# EAGLE design AirHarp Pico 1.001 (EAGLE 7.1.0)
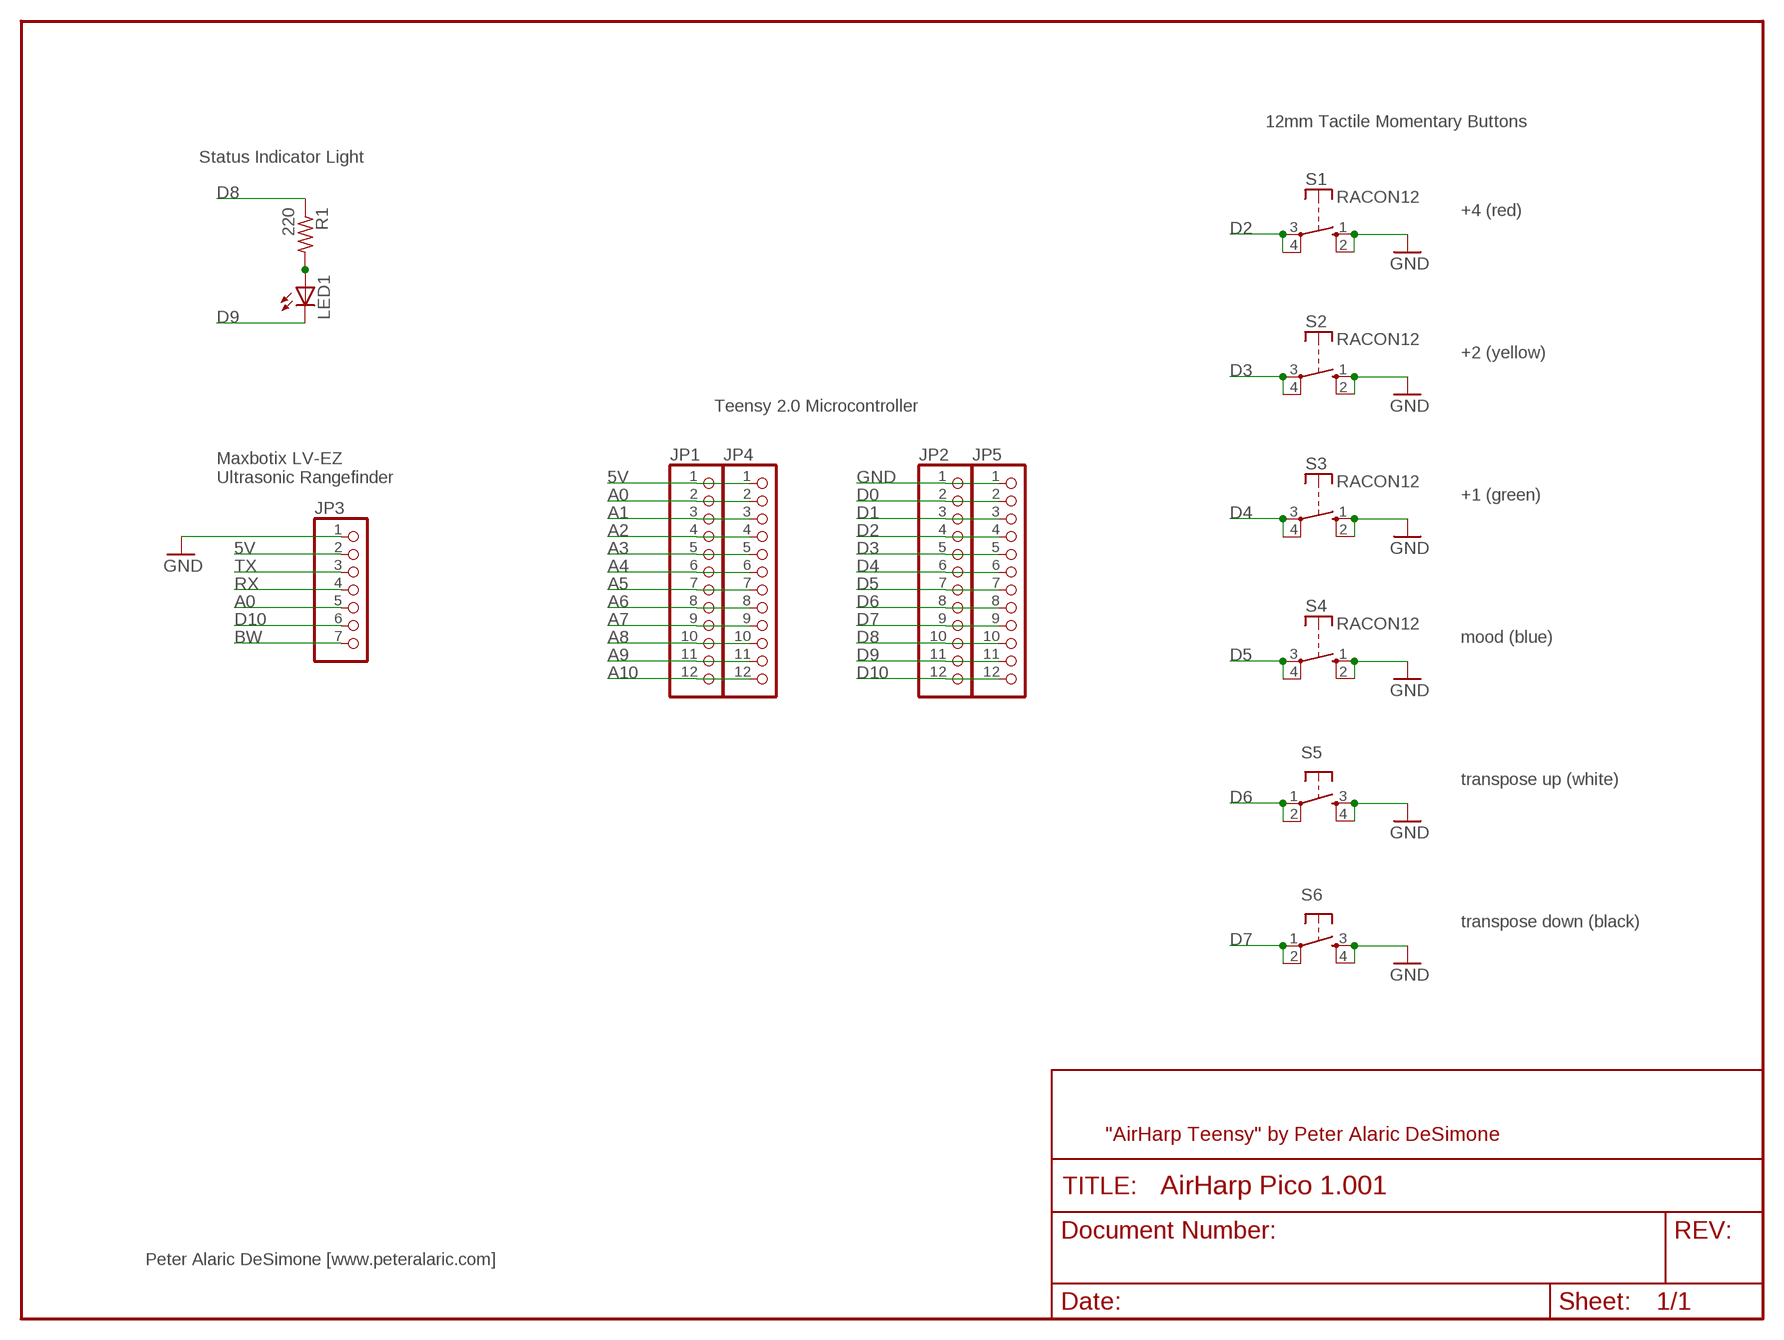
[diagram p0: schematic, sheet 1]

## Parts
JP1  PINHD-1X12  [1X12]
JP2  PINHD-1X12  [1X12]
JP3  PINHD-1X7  [1X07]
JP4  PINHD-1X12  [1X12]
JP5  PINHD-1X12  [1X12]
LED1  LED10MM  [LED10MM]
R1  220  R-US_0207/7  [0207/7]
S1  RACON12  [RACON12]
S2  RACON12  [RACON12]
S3  RACON12  [RACON12]
S4  RACON12  [RACON12]
S5  TAC_SWITCHPTH  [TACTILE-PTH]
S6  TAC_SWITCHPTH  [TACTILE-PTH]

## Nets
5V: JP1.1 JP3.2 JP4.1
A0: JP1.2 JP3.5 JP4.2
A1: JP1.3 JP4.3
A2: JP1.4 JP4.4
A3: JP1.5 JP4.5
A4: JP1.6 JP4.6
A5: JP1.7 JP4.7
A6: JP1.8 JP4.8
A7: JP1.9 JP4.9
A8: JP1.10 JP4.10
A9: JP1.11 JP4.11
A10: JP1.12 JP4.12
BW: JP3.7
D0: JP2.2 JP5.2
D1: JP2.3 JP5.3
D2: JP2.4 JP5.4 S1.3(P) S1.4(P)
D3: JP2.5 JP5.5 S2.3(P) S2.4(P)
D4: JP2.6 JP5.6 S3.3(P) S3.4(P)
D5: JP2.7 JP5.7 S4.3(P) S4.4(P)
D6: JP2.8 JP5.8 S5.1 S5.2
D7: JP2.9 JP5.9 S6.1 S6.2
D8: JP2.10 JP5.10 R1.1
D9: JP2.11 JP5.11 LED1.K(C)
D10: JP2.12 JP3.6 JP5.12
GND: JP2.1 JP3.1 JP5.1 S1.1(S) S1.2(S) S2.1(S) S2.2(S) S3.1(S) S3.2(S) S4.1(S) S4.2(S) S5.3 S5.4 S6.3 S6.4
N$1: LED1.A R1.2
RX: JP3.4
TX: JP3.3

## Notes on the sheet
- 12mm Tactile Momentary Buttons
- Status Indicator Light
- +4 (red)
- +2 (yellow)
- Teensy 2.0 Microcontroller
- Maxbotix LV-EZ
  Ultrasonic Rangefinder
- +1 (green)
- mood (blue)
- transpose up (white)
- transpose down (black)
- "AirHarp Teensy" by Peter Alaric DeSimone
- Peter Alaric DeSimone [www.peteralaric.com]

## Library data of the parts
JP1 JP2 JP4 JP5 = pinhead:PINHD-1X12: PIN HEADER
JP3 = pinhead:PINHD-1X7: PIN HEADER
LED1 = led:LED: LED OSRAM: - CHIPLED LG R971, LG N971, LY N971, LG Q971, LY Q971, LO R971, LY R971 LH N974, LH R974 LS Q976, LO Q976, LY Q976 LO Q996 - Hyper CHIPLED LW Q18S LB Q993, LB Q99A, LB R99A - SideLED LS A670, LO A670, LY A670, LG A670, LP A670 LB A673, LV A673, LT A673, LW A673 LH A674 LY A675 LS A676, LA A676, LO A676, LY A676, LW A676 LS A679, LY A679, LG A679 - Hyper Micro SIDELED® LS Y876, LA Y876, LO Y876, LY Y876 LT Y87S - SmartLED LW L88C, LW L88S LB L89C, LB L89S, LG L890 LS L89K, LO L89K, LY L89K LS L896, LA L896, LO L896, LY L896 - TOPLED LS T670, LO T670, LY T670, LG T670, LP T670 LSG T670, LSP T670, LSY T670, LOP T670, LYG T670 LG T671, LOG T671, LSG T671 LB T673, LV T673, LT T673, LW T673 LH T674 LS T676, LA T676, LO T676, LY T676, LB T676, LH T676, LSB T676, LW T676 LB T67C, LV T67C, LT T67C, LS T67K, LO T67K, LY T67K, LW E67C LS E67B, LA E67B, LO E67B, LY E67B, LB E67C, LV E67C, LT E67C LW T67C LS T679, LY T679, LG T679 LS T770, LO T770, LY T770, LG T770, LP T770 LB T773, LV T773, LT T773, LW T773 LH T774 LS E675, LA E675, LY E675, LS T675 LS T776, LA T776, LO T776, LY T776, LB T776 LHGB T686 LT T68C, LB T68C - Hyper Mini TOPLED® LB M676 - Mini TOPLED Santana® LG M470 LS M47K, LO M47K, LY M47K Source: http://www.osram.convergy.de LUXEON: - LUMILED® LXK2-PW12-R00, LXK2-PW12-S00, LXK2-PW14-U00, LXK2-PW14-V00 LXK2-PM12-R00, LXK2-PM12-S00, LXK2-PM14-U00 LXK2-PE12-Q00, LXK2-PE12-R00, LXK2-PE12-S00, LXK2-PE14-T00, LXK2-PE14-U00 LXK2-PB12-K00, LXK2-PB12-L00, LXK2-PB12-M00, LXK2-PB14-N00, LXK2-PB14-P00, LXK2-PB14-Q00 LXK2-PR12-L00, LXK2-PR12-M00, LXK2-PR14-Q00, LXK2-PR14-R00 LXK2-PD12-Q00, LXK2-PD12-R00, LXK2-PD12-S00 LXK2-PH12-R00, LXK2-PH12-S00 LXK2-PL12-P00, LXK2-PL12-Q00, LXK2-PL12-R00 Source: www.luxeon.com KINGBRIGHT: KA-3528ASYC Source: www.kingbright.com
R1 = resistor:R-US_: RESISTOR, American symbol
S1-S4 = switch-misc:RACON12: ITT SWITCH
S5 S6 = SparkFun-Retired:TAC_SWITCH: Momentary Switch Button commonly used for reset or general input. Spark Fun Electronics SKU : COM-00097 SMT- SWCH-08247

## Net classes
1 power: width 0.254 mm

## Board
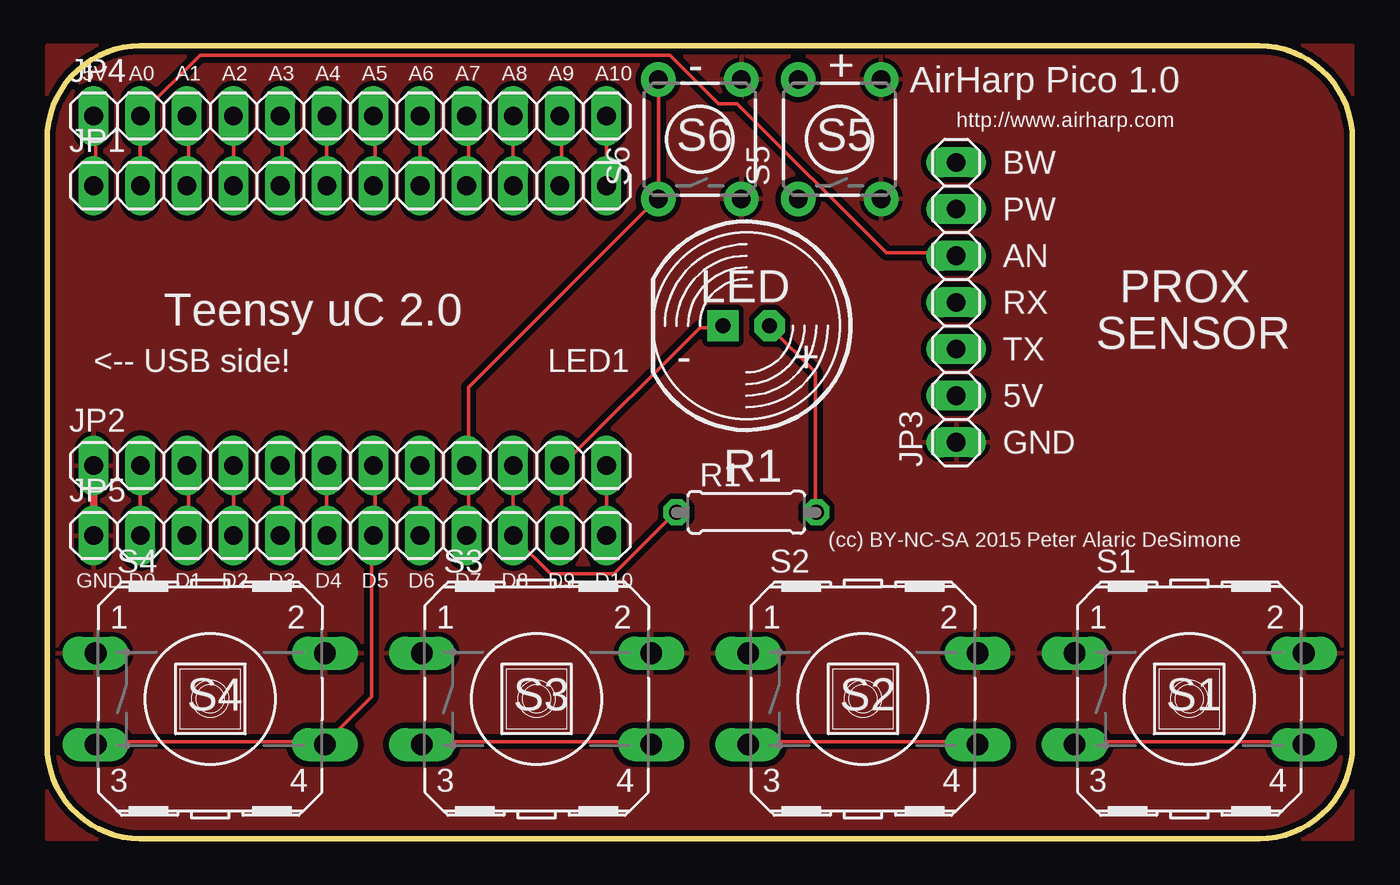
[diagram p1: board, top side]
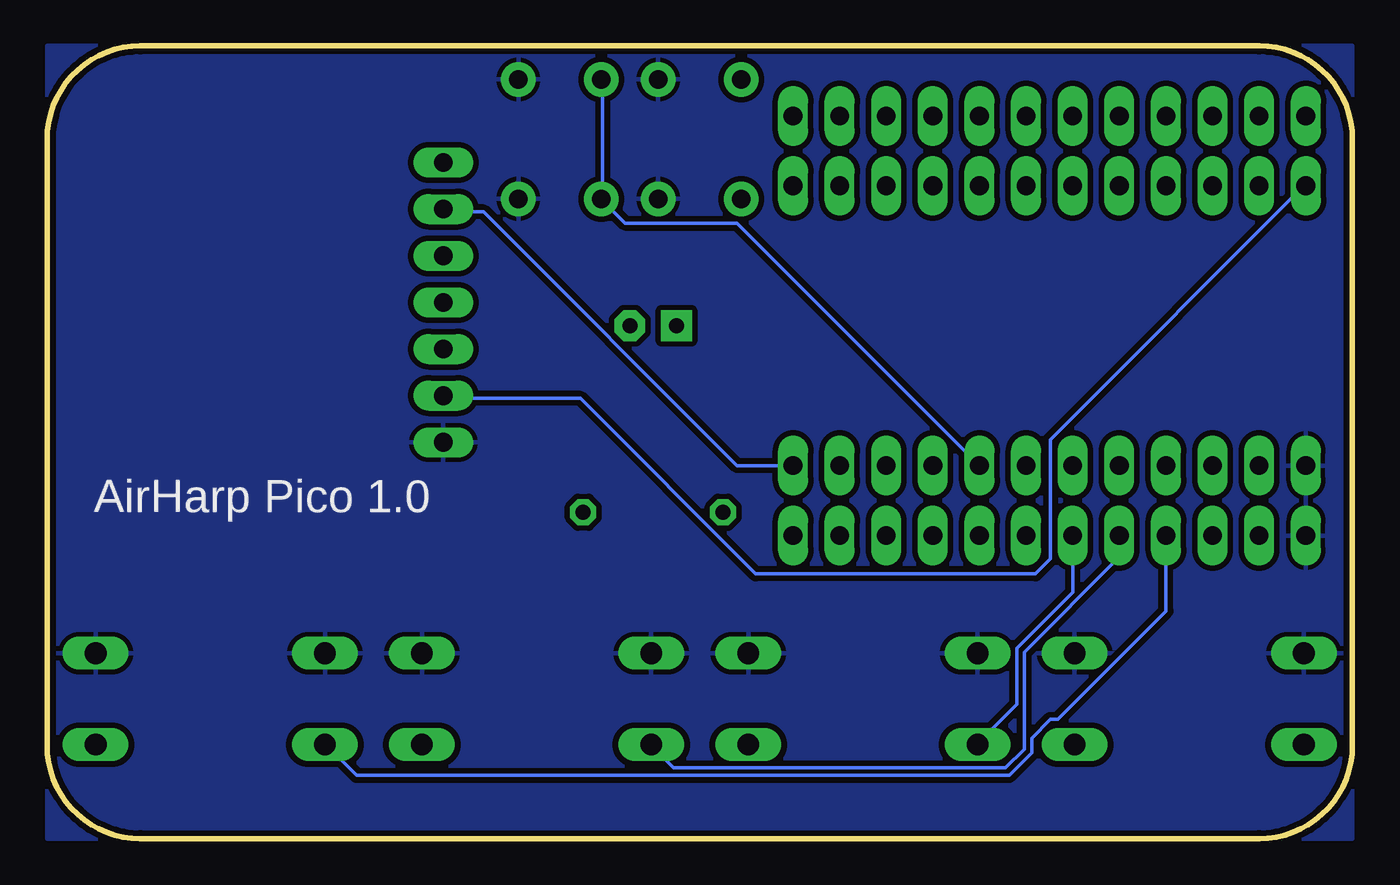
[diagram p2: board, bottom side, seen from below]

Size 71.12 x 43.18 mm. Coordinates in mm from the lower left corner, seen from the top.
Outline: 0,38.1 arc-90 5.08,43.18 66.04,43.18 arc-90 71.12,38.1 71.12,5.08 arc-90 66.04,0 5.08,0 arc-90 0,5.08 0,38.1
Copper layers (1*16): Top 0.035mm / dielectric 1.5mm / Bottom 0.035mm
Design rules "SparkFun": minimum track width 8mil, minimum drill 20mil, track to track 8mil, track to pad 8mil, pad to pad 8mil, via to via 8mil, smd to smd 8mil, copper to edge 10mil, drill to drill 8mil, minimum pad ring 12mil, minimum via ring 10mil, stop-mask expansion 4mil, vias tented up to drill 20mil, thermal gap 10mil

### Footprints (pad centres in the part's own frame; a part is rotated, then mirrored left to right if it is on the bottom)
1X12 = drill 1.016 long: 1 -13.97,0; 2 -11.43,0; 3 -8.89,0; 4 -6.35,0; 5 -3.81,0; 6 -1.27,0; 7 1.27,0; 8 3.81,0; 9 6.35,0; 10 8.89,0; 11 11.43,0; 12 13.97,0
1X07 = drill 1.016 long: 1 -7.62,0; 2 -5.08,0; 3 -2.54,0; 4 0,0; 5 2.54,0; 6 5.08,0; 7 7.62,0
LED10MM = drill 0.813 pad 1.676 octagon: A -1.27,0 | drill 0.813 pad 1.676 square: K 1.27,0
0207/7 = drill 0.813 octagon: 1 -3.81,0; 2 3.81,0
RACON12 = drill 1.194 long: 1 -6.248,2.489; 2 6.248,2.489; 3 -6.248,-2.489; 4 6.248,-2.489
TACTILE-PTH = drill 1.016 pad 1.88: 1 -3.251,2.261; 2 3.251,2.261; 3 -3.251,-2.261; 4 3.251,-2.261

### Placement (x,y rotation side)
JP1  16.51,35.56 0 top
JP2  16.51,20.32 0 top
JP3  49.53,29.21 90 top
JP4  16.51,39.37 0 top
JP5  16.51,16.51 0 top
LED1  38.1,27.94 180 top
R1  38.1,17.78 0 top
S1  62.23,7.62 0 top
S2  44.45,7.62 0 top
S3  26.67,7.62 0 top
S4  8.89,7.62 0 top
S5  43.18,38.1 90 top
S6  35.56,38.1 90 top

### Tracks (layer width: path | path; a pad name or v marks a point on that pad's centre or on a via)
5V
  Top 0.203: JP1.1 2.64,35.56 2.64,39.22 JP4.1
  Bottom 0.203: JP3.2 49.38,23.98 42.06,23.98 32.51,14.43 17.27,14.43 16.46,15.24 16.46,21.74 2.64,35.56 JP1.1
A0
  Top 0.203: JP1.2 JP4.2 5.08,39.42 8.33,42.67 33.93,42.67 36.58,40.03 37.59,40.03 45.72,31.9 49.38,31.9 JP3.5
A1
  Top 0.203: JP1.3 7.72,35.56 7.72,39.22 JP4.3
A2
  Top 0.203: JP4.4 JP1.4
A3
  Top 0.203: JP1.5 12.8,35.56 12.8,39.22 JP4.5
A4
  Top 0.203: JP4.6 JP1.6
A5
  Top 0.203: JP1.7 17.88,35.56 17.88,39.22 JP4.7
A6
  Top 0.203: JP4.8 JP1.8
A7
  Top 0.203: JP1.9 22.96,35.56 22.96,39.22 JP4.9
A8
  Top 0.203: JP4.10 JP1.10
A9
  Top 0.203: JP1.11 28.04,35.56 28.04,39.22 JP4.11
A10
  Top 0.203: JP4.12 JP1.12
D0
  Top 0.203: JP2.2 JP5.2
D1
  Top 0.203: JP5.3 7.72,16.66 7.72,20.32 JP2.3
D2
  Top 0.203: JP2.4 JP5.4 | S1.3 56.08,5.28 68.48,5.28 S1.4
  Bottom 0.203: JP5.4 10.16,12.39 16.05,6.5 16.46,6.5 17.48,5.49 17.48,4.67 18.69,3.45 54.25,3.45 55.88,5.08 S1.3
D3
  Top 0.203: JP5.5 12.8,16.66 12.8,20.32 JP2.5 | S2.3 38.2,5.28 50.6,5.28 S2.4
  Bottom 0.203: JP5.5 12.8,16.46 12.8,15.24 17.88,10.16 17.88,4.88 18.9,3.86 36.98,3.86 38.2,5.08 S2.3
D4
  Top 0.203: JP2.6 JP5.6 | S3.3 20.52,5.28 32.92,5.28 S3.4
  Bottom 0.203: JP5.6 15.24,13.41 18.29,10.36 18.29,7.32 20.32,5.28 S3.3
D5
  Top 0.203: JP2.7 17.88,20.32 17.88,16.66 JP5.7 17.68,16.46 17.68,7.72 15.24,5.28 S4.4 15.04,5.28 2.64,5.28 S4.3
D6
  Top 0.203: JP2.8 JP5.8
  Bottom 0.203: S5.2 40.84,41.25 40.84,34.95 S5.1 40.84,34.75 39.62,33.53 33.53,33.53 JP2.8
D7
  Top 0.203: 22.96,20.32 22.96,16.66 JP5.9 | S6.2 33.33,41.25 33.33,34.95 S6.1 33.12,34.75 22.96,24.59 22.96,20.32 | 22.96,20.32 JP2.9
D8
  Top 0.203: R1.1 34.14,17.68 30.89,14.43 27.43,14.43 25.4,16.46 JP5.10 JP2.10
D9
  Top 0.203: 28.04,20.32 28.04,16.66 JP5.11 | 28.04,20.32 35.56,27.84 36.78,27.84 LED1.K | 28.04,20.32 JP2.11
D10
  Top 0.203: JP2.12 JP5.12
  Bottom 0.203: JP2.12 33.53,20.32 47.35,34.14 49.38,34.14 JP3.6
GND
  Top 0.406: JP2.1 JP5.1
  pour Top (isolate 0.305): 0,43.18 71.12,43.18 71.12,0 0,0
  pour Bottom (isolate 0.305): 0,43.18 71.12,43.18 71.12,0 0,0
N$1
  Top 0.203: R1.2 41.86,17.88 41.86,25.4 39.42,27.84 LED1.A

### Text on the board
_tsilk: 5V | A0 | A1 | A2 | A3 | A4 | A5 | A6 | A7 | A8 | A9 | A10 | - | + | AirHarp Pico 1.0 | http://www.airharp.com | S6 | S5 | BW | PW | AN | LED | RX | PROX | Teensy uC 2.0 | SENSOR | TX | <-- USB side! | - | + | 5V | GND | R1 | (cc) BY-NC-SA 2015 Peter Alaric DeSimone | GND | D0 | D1 | D2 | D3 | D4 | D5 | D6 | D7 | D8 | D9 | D10 | S4 | S3 | S2 | S1
_bsilk: AirHarp Pico 1.0